# Altium schematic sheet dsPIC33EP.SchDoc
size A3
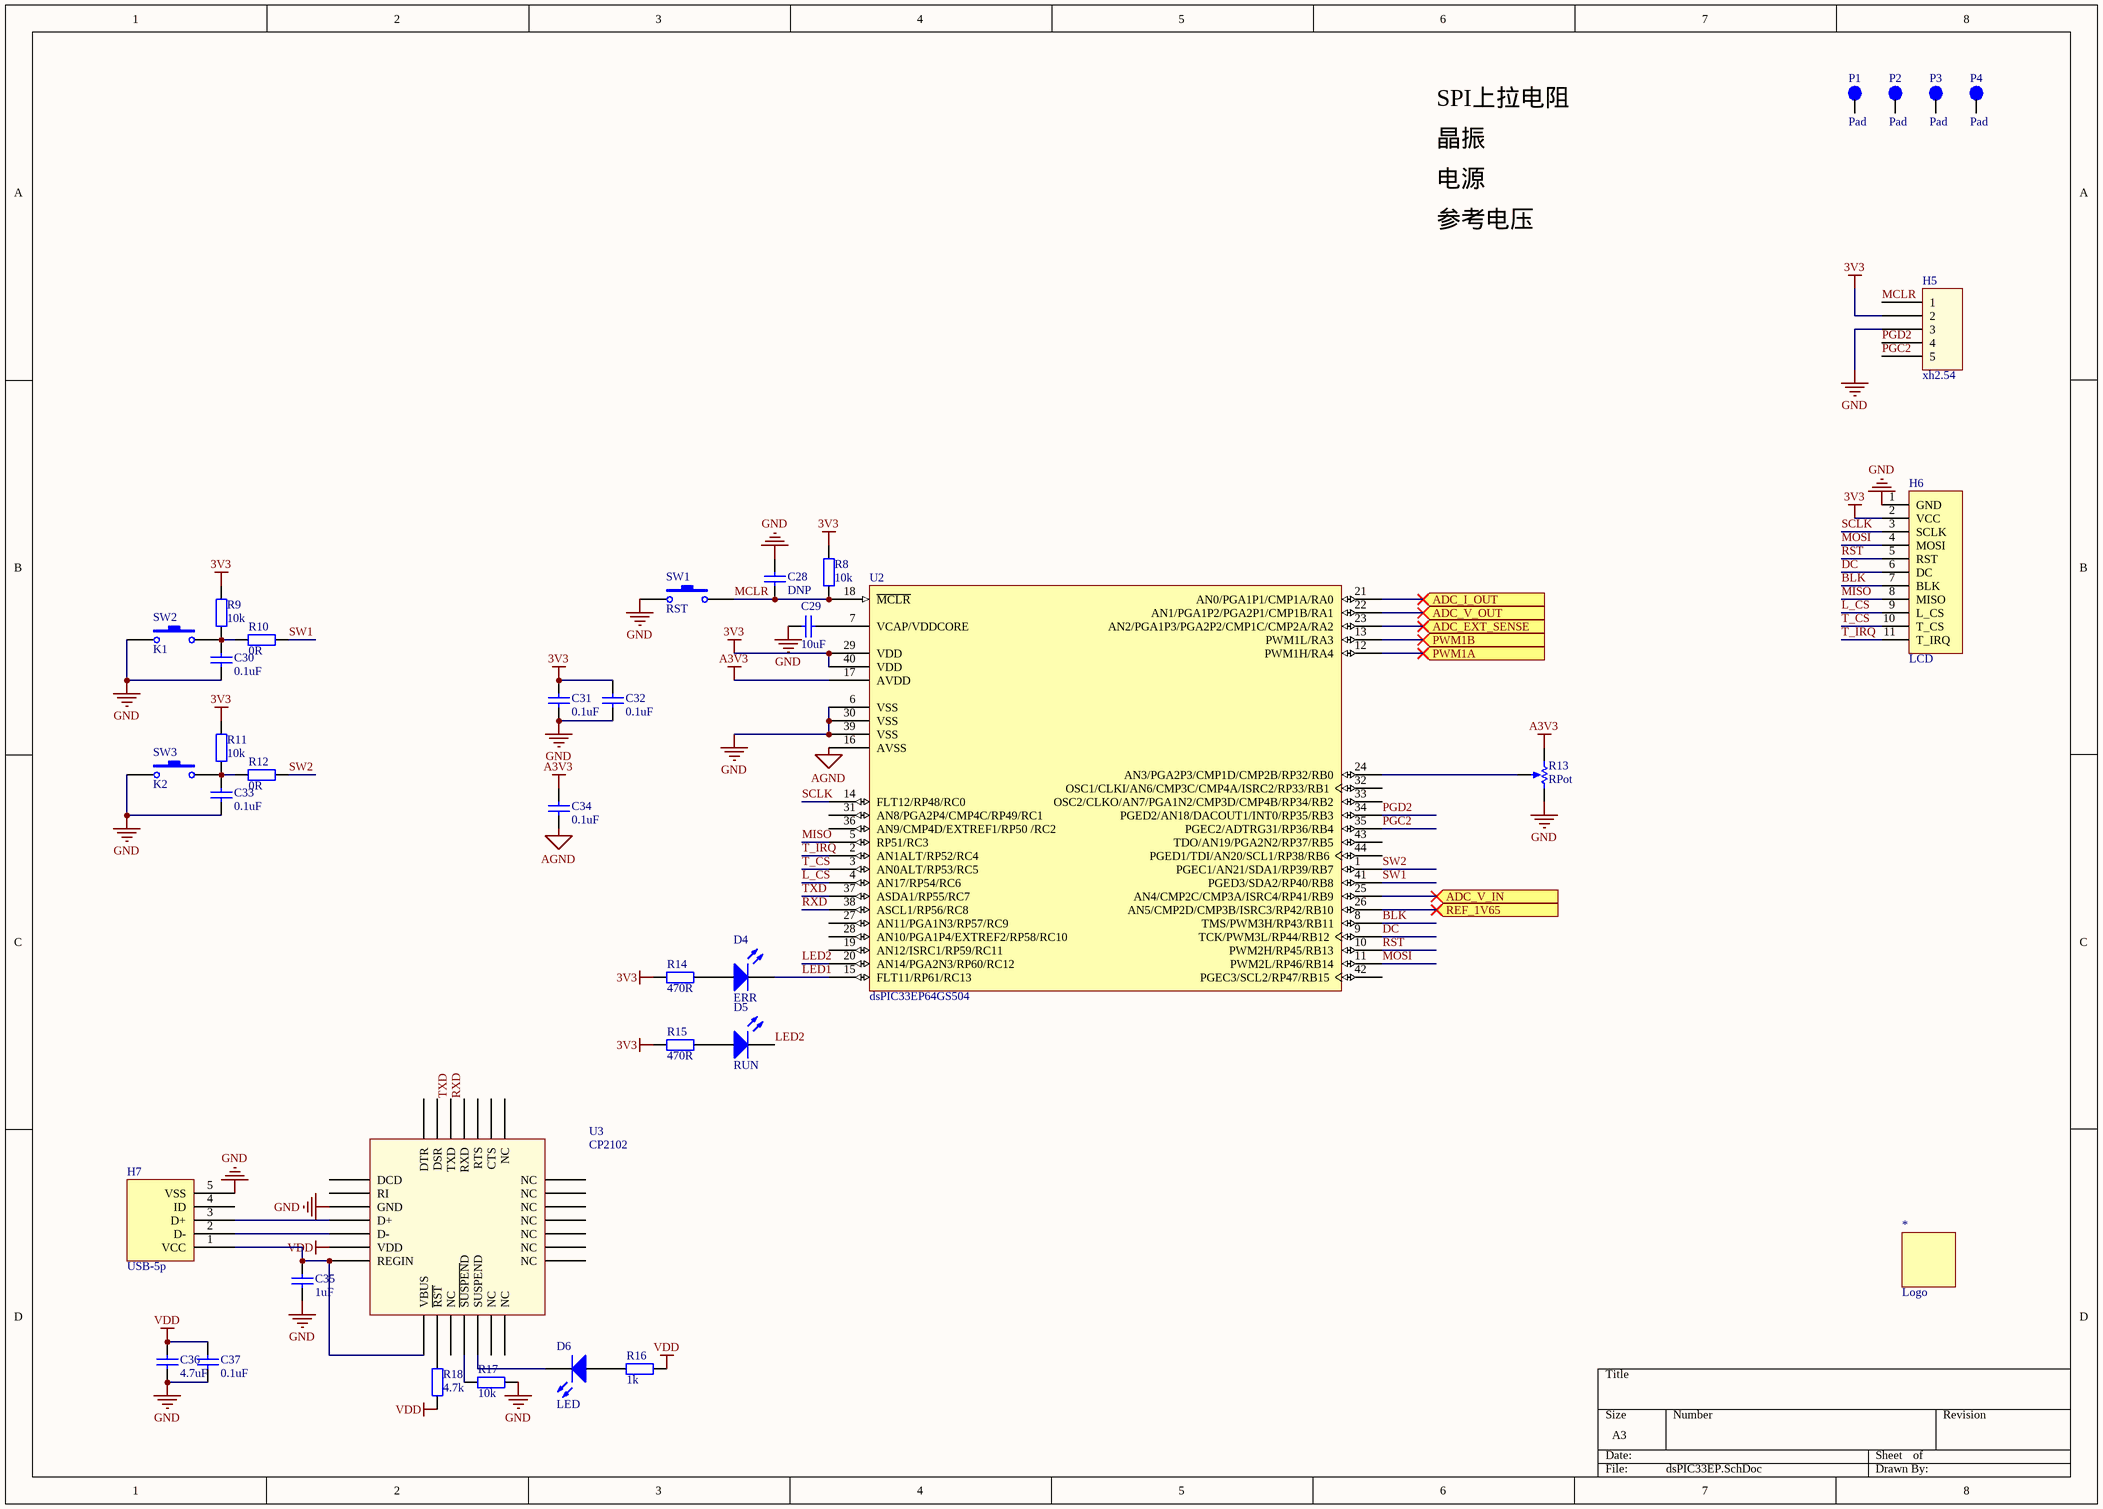
[diagram p0: dsPIC33EP.SchDoc]

## Parts
*  Logo  [USST]
C28  DNP  [CAP0603]
C29  10uF  [CAP0603]
C30  0.1uF  [CAP0603]
C31  0.1uF  [CAP0603]
C32  0.1uF  [CAP0603]
C33  0.1uF  [CAP0603]
C34  0.1uF  [CAP0603]
C35  1uF  [CAP0603]
C36  4.7uF  [CAP0603]
C37  0.1uF  [CAP0603]
D4  ERR  [LED0603]
D5  RUN  [LED0603]
D6  LED  [LED0603]
H5  xh2.54  [XH2.54_5A]
H6  LCD  [LCD-2.4']
H7  USB-5p  [USB_Micro]
P1  Pad  [PAD320R450]
P2  Pad  [PAD320R450]
P3  Pad  [PAD320R450]
P4  Pad  [PAD320R450]
R8  10k  [RES0603]
R9  10k  [RES0603]
R10  0R  [RES0603]
R11  10k  [RES0603]
R12  0R  [RES0603]
R13  RPot  [RM065]
R14  470R  [RES0603]
R15  470R  [RES0603]
R16  1k  [RES0603]
R17  10k  [RES0603]
R18  4.7k  [RES0603]
SW1  RST  [SW-PB SMD]
SW2  K1  [SW-PB SMD]
SW3  K2  [SW-PB SMD]
U2  dsPIC33EP64GS504  [TQFP-PT44_M]
U3  CP2102  [QFN28]

## Ports
ADC_EXT_SENSE (in), ADC_I_OUT (in), ADC_V_IN (in), ADC_V_OUT (in), PWM1A (in), PWM1B (in), REF_1V65 (in)

## Nets
3V3: C31.1 C32.1 H5.2 H6.2(VCC) R8.1 R9.1 R11.1 R14.2 R15.2 U2.29(VDD) U2.40(VDD)
A3V3: C34.1 R13.1(TOP) U2.17(AVDD)
AGND: C34.2 U2.16(AVSS)
GND: C28.1 C29.2 C30.2 C31.2 C32.2 C33.2 C35.1 C36.1 C37.1 H5.3 H6.1(GND) H7.5(VSS) R13.3(BOT) R17.2 SW1.1 SW2.1 SW3.1 U2.6(VSS) U2.30(VSS) U2.39(VSS) U3.3(GND) U3.29(GND)
VDD: C36.2 C37.2 R16.2 R18.2 U3.6(VDD)
ADC_EXT_SENSE: U2.23(AN2/PGA1P3/PGA2P2/CMP1C/CMP2A/RA2) ; port ADC_EXT_SENSE
ADC_I_OUT: U2.21(AN0/PGA1P1/CMP1A/RA0) ; port ADC_I_OUT
ADC_V_IN: U2.25(AN4/CMP2C/CMP3A/ISRC4/RP41/RB9) ; port ADC_V_IN
ADC_V_OUT: U2.22(AN1/PGA1P2/PGA2P1/CMP1B/RA1) ; port ADC_V_OUT
BLK: H6.7(BLK) U2.8(TMS/PWM3H/RP43/RB11)
DC: H6.6(DC) U2.9(TCK/PWM3L/RP44/RB12)
L_CS: H6.9(L_CS) U2.4(AN17/RP54/RC6)
LED1: D4.2(K) U2.15(FLT11/RP61/RC13)
LED2: D5.2(K) U2.20(AN14/PGA2N3/RP60/RC12)
MCLR: C28.2 H5.1 R8.2 SW1.2 U2.18(~{MCLR})
MISO: H6.8(MISO) U2.5(RP51/RC3)
MOSI: H6.4(MOSI) U2.11(PWM2L/RP46/RB14)
PGC2: H5.5 U2.35(PGEC2/ADTRG31/RP36/RB4)
PGD2: H5.4 U2.34(PGED2/AN18/DACOUT1/INT0/RP35/RB3)
PWM1A: U2.12(PWM1H/RA4) ; port PWM1A
PWM1B: U2.13(PWM1L/RA3) ; port PWM1B
REF_1V65: U2.26(AN5/CMP2D/CMP3B/ISRC3/RP42/RB10) ; port REF_1V65
RST: H6.5(RST) U2.10(PWM2H/RP45/RB13)
RXD: U2.38(ASCL1/RP56/RC8) U3.25(RXD)
SCLK: H6.3(SCLK) U2.14(FLT12/RP48/RC0)
SW1: R10.2 U2.41(PGED3/SDA2/RP40/RB8)
SW2: R12.2 U2.1(PGEC1/AN21/SDA1/RP39/RB7)
T_CS: H6.10(T_CS) U2.3(AN0ALT/RP53/RC5)
T_IRQ: H6.11(T_IRQ) U2.2(AN1ALT/RP52/RC4)
TXD: U2.37(ASDA1/RP55/RC7) U3.26(TXD)
NetC29_1: C29.1 U2.7(VCAP/VDDCORE)
NetC30_1: C30.1 R9.2 R10.1 SW2.2
NetC33_1: C33.1 R11.2 R12.1 SW3.2
NetC35_2: C35.2 H7.1(VCC) U3.7(REGIN) U3.8(VBUS)
NetD4_1: D4.1(A) R14.1
NetD5_1: D5.1(A) R15.1
NetD6_1: D6.1(A) R16.1
NetD6_2: D6.2(K) U3.12(SUSPEND)
NetH7_2: H7.2(D-) U3.5(D-)
NetH7_3: H7.3(D+) U3.4(D+)
NetR13_2: R13.2(TAP) U2.24(AN3/PGA2P3/CMP1D/CMP2B/RP32/RB0)
NetR17_1: R17.1 U3.11(~{SUSPEN}D)
NetR18_1: R18.1 U3.9(~{RST})

Not connected (* = marked no-connect by the designer): H7 4(ID); P1 1; P2 1; P3 1; P4 1; U2 19(AN12/ISRC1/RP59/RC11) 27(AN11/PGA1N3/RP57/RC9) 28(AN10/PGA1P4/EXTREF2/RP58/RC10) 31(AN8/PGA2P4/CMP4C/RP49/RC1) 32(OSC1/CLKI/AN6/CMP3C/CMP4A/ISRC2/RP33/RB1) 33(OSC2/CLKO/AN7/PGA1N2/CMP3D/CMP4B/RP34/RB2) 36(AN9/CMP4D/EXTREF1/RP50_/RC2) 42(PGEC3/SCL2/RP47/RB15) 43(TDO/AN19/PGA2N2/RP37/RB5) 44(PGED1/TDI/AN20/SCL1/RP38/RB6); U3 1(DCD) 2(RI) 10(NC) 13(NC) 14(NC) 15(NC) 16(NC) 17(NC) 18(NC) 19(NC) 20(NC) 21(NC) 22(NC) 23(CTS) 24(RTS) 27(DSR) 28(DTR)

## Notes on the sheet
- SPI上拉电阻
- 晶振
- 电源
- 参考电压

## Library data of the parts
C28 C29 C35 C36 = CAP: CAP NON-POL; Tolerance: +/-10%; Rated Voltage: 50V; Capacitance Value: 0.1uF
C30-C34 C37 = CAP: CAP NON-POL; Tolerance: +/-10%; Rated Voltage: 50V; Capacitance Value: 0.1uF
D4 D5 = LED
H5 = XH2.54_5P: pitch2.54
H6 = LCD_2.4': 2.4' TFT Module
H7 = USB_5P
R8-R12 R14-R18 = RES
R13 = RPot: Potentiometer
SW1-SW3 = SW-PB: push button